# EAGLE design ORPExpansion (EAGLE 6.1)
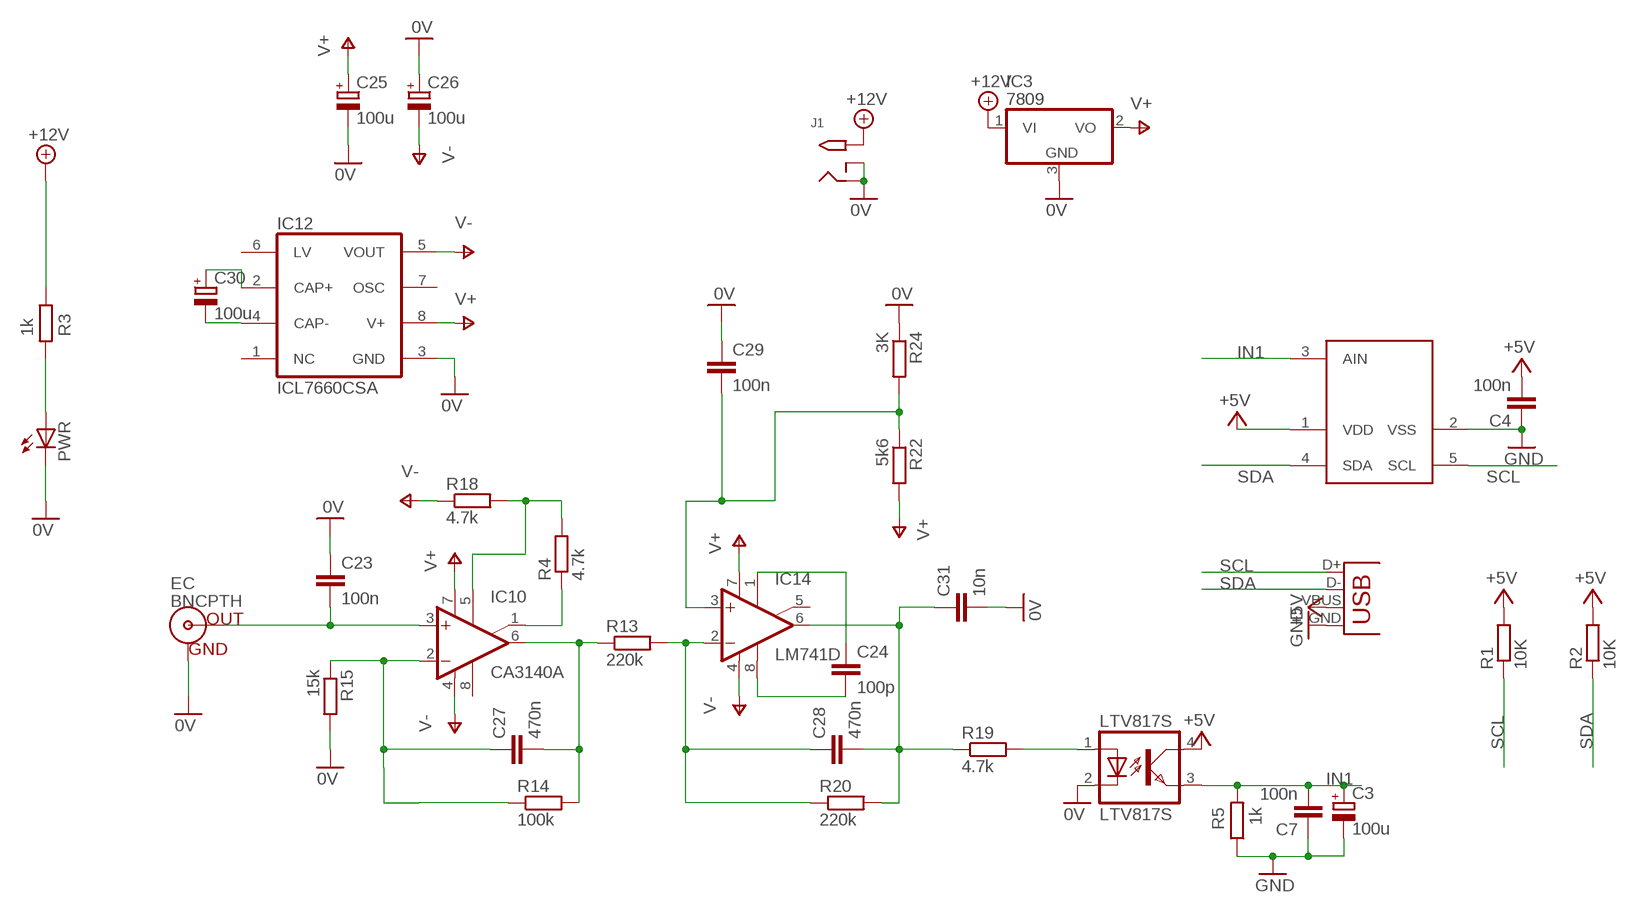
[diagram p0: schematic, sheet 1]

## Parts
C3  100u  CPOL-EUD  [PANASONIC_D]
C4  100n  C-EUC0805K  [C0805K]
C7  100n  C-EUC0805K  [C0805K]
C23  100n  C-EUC0805  [C0805]
C24  100p  C-EUC0805  [C0805]
C25  100u  CPOL-EUD  [PANASONIC_D]
C26  100u  CPOL-EUD  [PANASONIC_D]
C27  470n  C-EUC0805  [C0805]
C28  470n  C-EUC0805  [C0805]
C29  100n  C-EUC0805  [C0805]
C30  100u  CPOL-EUD  [PANASONIC_D]
C31  10n  C-EUC0805  [C0805]
EC  BNCPTH  [BNC]
IC3  7809  7805DT  [TO252]
IC10  CA3140A  CA3140D  [SO08]
IC12  ICL7660CSA  [SO08]
IC14  LM741D  [SO08]
J1  2.1MMJACKTHM  [PJ-102A]
LTV817S  LTV817S  LTV816S  [SMD4]
PWR  LED3MM  [LED3MM]
R1  10K  R-EU_R0805  [R0805]
R2  10K  R-EU_R0805  [R0805]
R3  1k  R-EU_R0805  [R0805]
R4  4.7k  R-EU_R0805  [R0805]
R5  1k  R-EU_R0805  [R0805]
R13  220k  R-EU_R0805  [R0805]
R14  100k  R-EU_R0805  [R0805]
R15  15k  R-EU_R0805  [R0805]
R18  4.7k  R-EU_R0805  [R0805]
R19  4.7k  R-EU_R0805  [R0805]
R20  220k  R-EU_R0805  [R0805]
R22  5k6  R-EU_R0805  [R0805]
R24  3K  R-EU_R0805  [R0805]
U$2  MCP3221  [SOT23-5]
X5  USBSMD  [USB-MINIB]

## Nets
0V: C23.1 C25.- C26.+ C29.1 C31.2 EC.GND IC3.3(GND) IC12.3(GND) J1.RING J1.RING_SW LTV817S.2(C) PWR.K(C) R15.2 R24.1
+5V: C4.2 LTV817S.4(COL) R1.2 R2.2 U$2.1(VDD) X5.VBUS
+12V: IC3.1(VI) J1.TIP R3.1
GND [gnd]: C3.- C4.1 C7.1 R5.1 U$2.2(VSS) X5.GND
IN1: C3.+ C7.2 LTV817S.3(EMIT) R5.2 U$2.3(AIN)
N$10: PWR.A R3.2
N$12: C24.1 IC14.1(ON1)
N$41: C29.2 IC14.3(+IN) R22.1 R24.2
N$42: C30.- IC12.4(CAP-)
N$43: C30.+ IC12.2(CAP+)
N$44: C23.2 EC.S(OUT) IC10.3(+IN)
N$45: C24.2 IC14.8(OPT)
N$47: C27.2 IC10.6(OUT) R13.1 R14.2
N$48: C27.1 IC10.2(-IN) R14.1 R15.1
N$50: IC10.5(ON) R4.2 R18.2
N$51: IC10.1(ON/CMP) R4.1
N$53: C28.1 IC14.2(-IN) R13.2 R20.1
N$54: LTV817S.1(A) R19.2
N$55: C28.2 C31.1 IC14.6(OUT) R19.1 R20.2
SCL: R1.1 U$2.5(SCL) X5.D+
SDA: R2.1 U$2.4(SDA) X5.D-
V+: C25.+ IC3.2(VO) IC10.7(V+) IC12.8(V+) IC14.7(V+) R22.2
V-: C26.- IC10.4(V-) IC12.5(VOUT) IC14.4(V-) R18.1
Unconnected: IC10.8(CMP) IC12.1(NC) IC12.6(LV) IC12.7(OSC) IC14.5(ON2)

## Library data of the parts
C3 C25 C26 C30 = rcl:CPOL-EU: POLARIZED CAPACITOR, European symbol
C4 C7 C23 C24 C27-C29 C31 = rcl:C-EU: CAPACITOR, European symbol
EC = SparkFun:BNC: BNC Connector, Mouser Part# 5227161
IC3 = adafruit:78*: Positive VOLTAGE REGULATOR Added bigger pads to the TO-92 package
IC10 = linear:CA3140: OP AMP
IC12 = maxim:ICL7660CSA: VOLTAGE CONVERTER
IC14 = linear:*741: OP AMP
J1 = adafruit:2.1MMJACK: 2.1mm x 5.5mm THM DC jack with internal switch. Digikey part #PJ-102A, 4UCON part #05537 2.1mm x 5.5mm SMT DC jack with internal switch. Digikey part #PJ-002A-SMT, 4UCON part #03267 By microbuilder.eu & adafruit.com
LTV817S = optocoupler:LTV816: OPTO COUPLER Source: LITEON, LTV816.pdf; OC_FARNELL: unknown; OC_NEWARK: unknown
PWR = led:LED: LED OSRAM: - CHIPLED LG R971, LG N971, LY N971, LG Q971, LY Q971, LO R971, LY R971 LH N974, LH R974 LS Q976, LO Q976, LY Q976 LO Q996 - Hyper CHIPLED LW Q18S LB Q993, LB Q99A, LB R99A - SideLED LS A670, LO A670, LY A670, LG A670, LP A670 LB A673, LV A673, LT A673, LW A673 LH A674 LY A675 LS A676, LA A676, LO A676, LY A676, LW A676 LS A679, LY A679, LG A679 - Hyper Micro SIDELED® LS Y876, LA Y876, LO Y876, LY Y876 LT Y87S - SmartLED LW L88C, LW L88S LB L89C, LB L89S, LG L890 LS L89K, LO L89K, LY L89K LS L896, LA L896, LO L896, LY L896 - TOPLED LS T670, LO T670, LY T670, LG T670, LP T670 LSG T670, LSP T670, LSY T670, LOP T670, LYG T670 LG T671, LOG T671, LSG T671 LB T673, LV T673, LT T673, LW T673 LH T674 LS T676, LA T676, LO T676, LY T676, LB T676, LH T676, LSB T676, LW T676 LB T67C, LV T67C, LT T67C, LS T67K, LO T67K, LY T67K, LW E67C LS E67B, LA E67B, LO E67B, LY E67B, LB E67C, LV E67C, LT E67C LW T67C LS T679, LY T679, LG T679 LS T770, LO T770, LY T770, LG T770, LP T770 LB T773, LV T773, LT T773, LW T773 LH T774 LS E675, LA E675, LY E675, LS T675 LS T776, LA T776, LO T776, LY T776, LB T776 LHGB T686 LT T68C, LB T68C - Hyper Mini TOPLED® LB M676 - Mini TOPLED Santana® LG M470 LS M47K, LO M47K, LY M47K Source: http://www.osram.convergy.de LUXEON: - LUMILED® LXK2-PW12-R00, LXK2-PW12-S00, LXK2-PW14-U00, LXK2-PW14-V00 LXK2-PM12-R00, LXK2-PM12-S00, LXK2-PM14-U00 LXK2-PE12-Q00, LXK2-PE12-R00, LXK2-PE12-S00, LXK2-PE14-T00, LXK2-PE14-U00 LXK2-PB12-K00, LXK2-PB12-L00, LXK2-PB12-M00, LXK2-PB14-N00, LXK2-PB14-P00, LXK2-PB14-Q00 LXK2-PR12-L00, LXK2-PR12-M00, LXK2-PR14-Q00, LXK2-PR14-R00 LXK2-PD12-Q00, LXK2-PD12-R00, LXK2-PD12-S00 LXK2-PH12-R00, LXK2-PH12-S00 LXK2-PL12-P00, LXK2-PL12-Q00, LXK2-PL12-R00 Source: www.luxeon.com KINGBRIGHT: KA-3528ASYC Source: www.kingbright.com
R1-R5 R13-R15 R18-R20 R22 R24 = rcl:R-EU_: RESISTOR, European symbol
U$2 = MCP3426:MCP3221
X5 = SparkFun:USB: USB Connectors USB-B-PTH is fully proven SKU : PRT-00139 USB-miniB is fully proven SKU : PRT-00587 USB-A-PCB is untested. USB-A-H is throughly reviewed, but untested. Spark Fun Electronics SKU : PRT-00437 USB-B-SMT is throughly reviewed, but untested. Needs silkscreen touching up. USB-A-S has not been used/tested USB-MB-H has not been used/tested

## Net classes
0 default: width 0.305 mm, drill 0.305 mm, clearance 0.203 mm
1 power: width 0.254 mm, drill 0.254 mm, clearance 0.229 mm
2 gnd: width 0.305 mm, drill 0.508 mm, clearance 0.203 mm

## Board
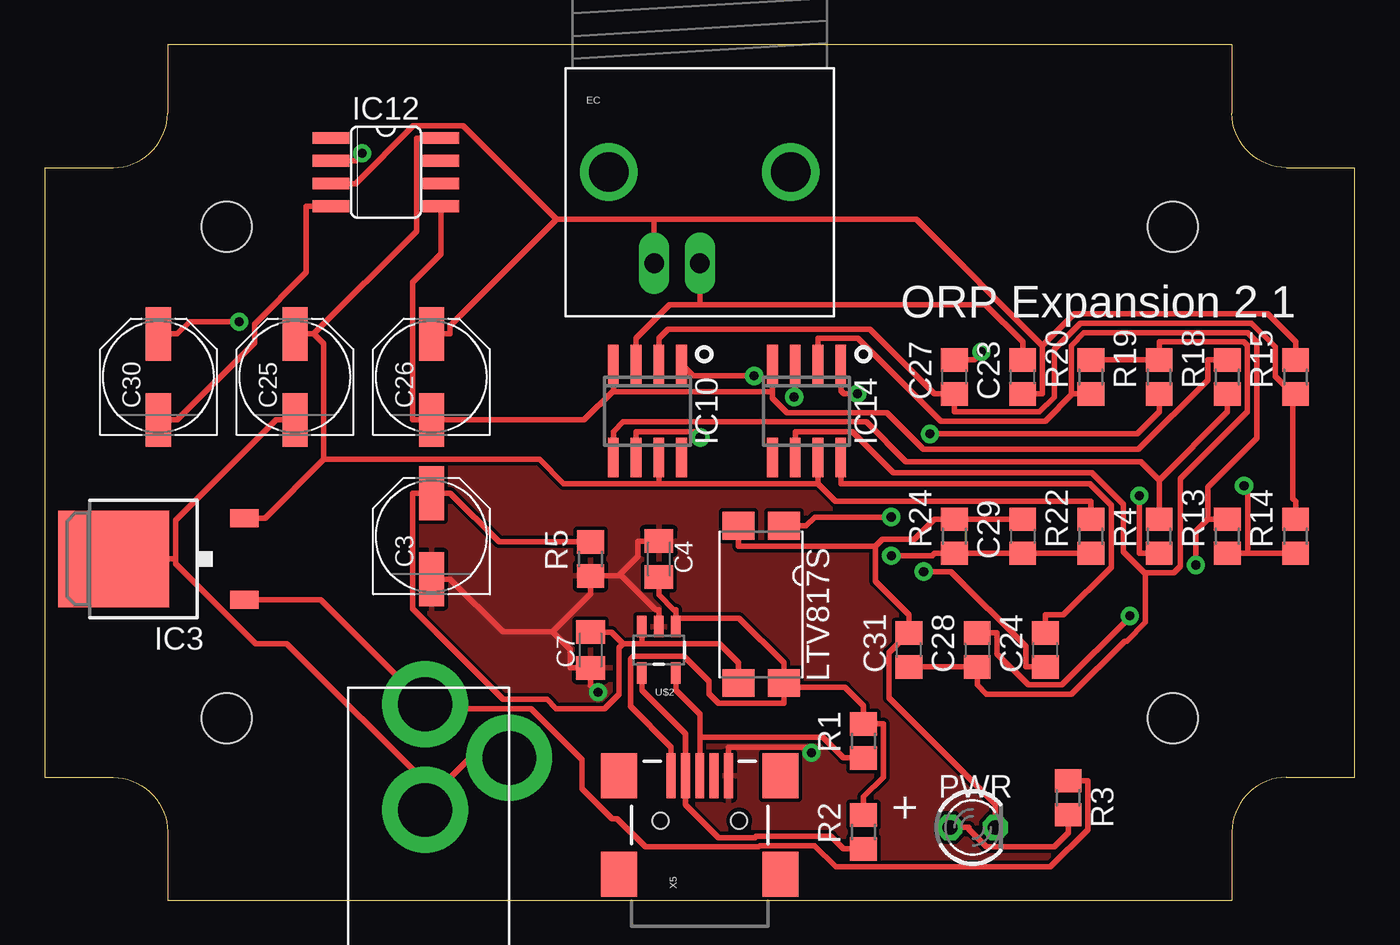
[diagram p1: board, top side]
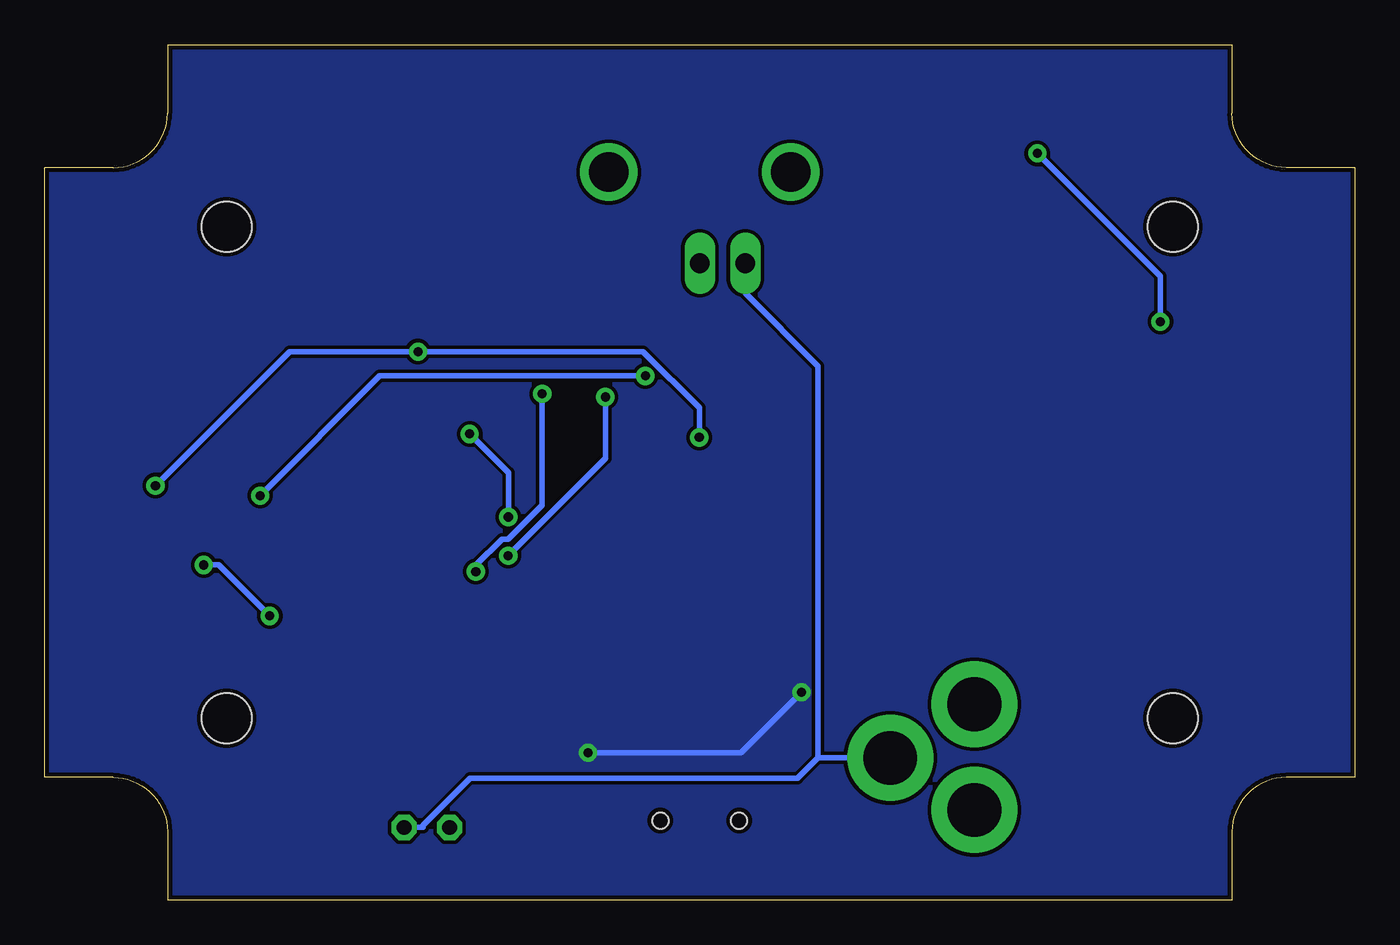
[diagram p2: board, bottom side, seen from below]

Size 73.15 x 47.75 mm. Coordinates in mm from the lower left corner, seen from the top.
Outline: 73.15,6.86 73.15,40.89 69.34,40.89 arc-90 66.29,43.94 66.29,47.75 6.86,47.75 6.86,43.94 arc-90 3.81,40.89 0,40.89 0,6.86 3.81,6.86 arc-90 6.86,3.81 6.86,0 66.29,0 66.29,3.81 arc-90 69.34,6.86 73.15,6.86
Copper layers (1*16): Top 0.035mm / dielectric 1.5mm / Bottom 0.035mm
Design rules: minimum track width 8mil, minimum drill 20mil, track to track 8mil, track to pad 8mil, pad to pad 8mil, via to via 8mil, smd to smd 8mil, copper to edge 10mil, drill to drill 8mil, minimum pad ring 12mil, minimum via ring 10mil, stop-mask expansion 4mil, vias tented up to drill 25mil, thermal gap 10mil
Holes 2.8 mm at 10.16,10.16 10.16,37.59 62.99,37.59 62.99,10.16

### Footprints (pad centres in the part's own frame; a part is rotated, then mirrored left to right if it is on the bottom)
PANASONIC_D = smd 3 x 1.4: + 2.4,0; - -2.4,0
C0805K = smd 1.3 x 1.6: 1 -1,0; 2 1,0
C0805 = smd 1.3 x 1.5: 1 -0.95,0; 2 0.95,0
BNC = drill 2.2: 3 -5.08,5.08; 4 5.08,5.08 | drill 1.1 long: GND -2.54,0; S 0,0
TO252 = smd 1 x 1.6: 1 -2.28,-4.8; 2 2.28,-4.8 | smd 5.4 x 6.2: 3 0,2.5
SO08 = smd 0.6 x 2.2: 1 -1.905,-2.6; 2 -0.635,-2.6; 3 0.635,-2.6; 4 1.905,-2.6; 5 1.905,2.6; 6 0.635,2.6; 7 -0.635,2.6; 8 -1.905,2.6
SO08' = smd 0.66 x 2.032: 1 -1.905,-3.073; 2 -0.635,-3.073; 3 0.635,-3.073; 4 1.905,-3.073; 5 1.905,3.073; 6 0.635,3.073; 7 -0.635,3.073; 8 -1.905,3.073
PJ-102A = drill 3 pad 4.8: RING 0.1,-3.39; RING_SW -4.6,-6.29; TIP 0.1,-9.29
SMD4 = smd 1.78 x 1.55: 1 -1.27,-4.389; 2 1.27,-4.389; 3 1.27,4.389; 4 -1.27,4.389
LED3MM = drill 0.813 octagon: A -1.27,0; K 1.27,0
R0805 = smd 1.3 x 1.5: 1 -0.95,0; 2 0.95,0
SOT23-5 = smd 0.55 x 1.2: 1 -0.95,-1.3; 2 0,-1.3; 3 0.95,-1.3; 4 0.95,1.3; 5 -0.95,1.3
USB-MINIB = smd 2.5 x 0.5: D+ 2.5,0; D- 2.5,0.8; GND 2.5,-1.6; ID 2.5,-0.8; VBUS 2.5,1.6 | smd 2.5 x 2: GND@1 -3,-4.5; GND@2 -3,4.5; GND@3 2.5,4.5; GND@4 2.5,-4.5 | hole 0.9: 0,2.2; 0,-2.2

### Placement (x,y rotation side)
C3  21.59,20.32 90 top
C4  34.29,19.05 270 top
C7  30.48,13.97 90 top
C23  54.61,29.21 90 top
C24  55.88,13.97 90 top
C25  13.97,29.21 90 top
C26  21.59,29.21 90 top
C27  50.8,29.21 90 top
C28  52.07,13.97 270 top
C29  54.61,20.32 270 top
C30  6.35,29.21 90 top
C31  48.26,13.97 90 top
EC  36.58,35.56 0 top
IC3  6.35,19.05 90 top
IC10  33.66,27.3 180 top
IC12  ICL7660CSA  [SO08']  19.05,40.64 270 top
IC14  42.55,27.3 180 top
J1  21.34,1.65 180 top
LTV817S  40.01,16.51 180 top
PWR  51.82,4.06 0 top
R1  45.72,8.89 90 top
R2  45.72,3.81 90 top
R3  57.15,5.71 270 top
R4  62.23,20.32 90 top
R5  30.48,19.05 90 top
R13  66.04,20.32 90 top
R14  69.85,20.32 270 top
R15  69.85,29.21 90 top
R18  66.04,29.21 270 top
R19  62.23,29.21 270 top
R20  58.42,29.21 90 top
R22  58.42,20.32 90 top
R24  50.8,20.32 270 top
U$2  34.29,13.97 180 top
X5  36.58,4.45 90 top

### Tracks (layer width: path | path; a pad name or v marks a point on that pad's centre or on a via)
0V
  Top 0.305: 21.83,6.02 13.52,14.33 11.78,14.33 7.31,18.8 7.31,19.05 | J1.RING 21.83,5.63 21.83,6.02 | J1.RING_SW 23.75,7.94 21.83,6.02 | R15.2 69.85,31.17 68.29,32.73 57.48,32.73 55.72,30.96 | 55.72,30.96 55.72,28.26 C23.1 | 34.04,38.01 48.67,38.01 55.72,30.96 | 28.58,38.01 34.04,38.01 | 46.39,19.77 46.77,20.14 48.57,20.14 49.69,21.27 R24.1 C29.1 | 46.39,19.77 46.39,17.79 48.26,15.93 C31.2 47.15,13.82 47.15,11.29 53.09,5.36 PWR.K | 46.39,19.77 38.73,19.77 LTV817S.2 | C25.- 12.91,26.81 7.31,21.2 7.31,19.05 | C26.+ 22.65,31.61 22.65,32.07 28.58,38.01 | 28.58,38.01 23.35,43.23 20.57,43.23 17.35,40.01 IC12.3 | IC3.3 7.31,19.05 | EC.GND 34.04,38.01
  Bottom 0.305: 29.98,7.94 29.98,29.82 34.04,33.88 EC.GND | 29.98,7.94 31.12,6.8 49.41,6.8 52.02,4.2 52.02,4.06 PWR.K | 29.98,7.94 J1.RING_SW
+5V
  Top 0.305: R2.2 45.72,5.77 46.83,6.87 46.83,9.84 R1.2 45.72,10.85 44.69,11.88 41.27,11.88 | 41.27,11.88 41.27,10.99 37.63,10.99 37.08,11.53 37.08,12.23 35.69,13.63 32.89,13.63 32.71,13.44 32.71,10.82 34.98,8.55 X5.VBUS | 41.27,11.88 LTV817S.4 41.27,13.25 38.78,15.75 35.24,15.75 | 35.24,15.75 35.24,16.23 35.11,16.23 34.29,17.04 C4.2 | U$2.1 35.24,15.75
+12V
  Top 0.305: R3.1 58.26,6.67 58.26,3.94 56.17,1.85 44.19,1.85 42.99,3.05 39.93,3.05 39.86,2.98 33.54,2.98 31.96,4.55 31.66,4.55 29.99,6.23 29.99,7.85 27.14,10.7 21.48,10.7 J1.TIP 15.41,16.77 IC3.1
GND  (via drill 0.51 pad 1.02)
  Top 0.305: v30.9,11.6 30.54,11.96 30.48,11.96 C7.1 29.32,12.97 29.32,14.01 28.36,14.97 | 28.36,14.97 25.59,14.97 22.65,17.92 C3.- | 28.36,14.97 30.48,17.09 R5.1 30.93,18.1 31.59,18.1 32.02,18.1 32.12,18.2 | 32.12,18.2 33.13,19.21 33.13,20.05 C4.1 | 32.12,18.2 34.09,16.23 34.29,16.23 U$2.2 | v42.81,8.23 42.49,8.55 38.18,8.55 X5.GND
  Bottom 0.305: v42.81,8.23 34.26,8.23 v30.9,11.6
  pour Top: -1.27,49.53 74.93,49.53 74.93,0 -1.27,0
  pour Bottom: -1.27,50.8 76.2,50.8 76.2,-1.27 -1.27,-1.27
IN1
  Top 0.305: 32.29,14.31 32.08,14.1 32.08,11.51 31.26,10.7 28.56,10.7 28.06,11.21 25.59,11.21 20.53,16.27 20.53,22.72 C3.+ 22.65,22.72 25.37,20 29.57,20 R5.2 | 33.34,14.31 32.29,14.31 | 32.29,14.31 31.64,14.97 C7.2 | LTV817S.3 38.73,13.25 37.67,14.31 33.34,14.31 | U$2.3 33.34,14.31
N$10
  Top 0.305: PWR.A 51.61,4.06 51.61,3.95 52.58,2.99 56.38,2.99 57.15,3.76 R3.2
N$12  (via drill 0.51 pad 1.02)
  Top 0.305: v45.37,28.27 44.63,28.27 44.45,28.45 IC14.1 | C24.1 54.77,13.02 54.77,14.17 50.6,18.34 v49.08,18.34
  Bottom 0.305: v49.08,18.34 49.08,18.69 47.63,20.14 47.28,20.14 45.37,22.05 v45.37,28.27
N$41  (via drill 0.51 pad 1.02)
  Top 0.305: IC14.3 41.91,28.16 v41.85,28.09 | v47.27,19.23 49.56,19.23 49.69,19.37 R24.2 C29.2 R22.1
  Bottom 0.305: v47.27,19.23 41.85,24.66 v41.85,28.09
N$42
  Top 0.305: C30.- 7.41,26.81 11.71,31.12 11.71,32.16 14.61,35.05 14.61,38.73 IC12.4
N$43  (via drill 0.51 pad 1.02)
  Top 0.305: IC12.2 17.35,41.27 17.35,41.32 v17.73,41.69 | C30.+ 7.41,31.61 8.09,32.3 v10.85,32.3
  Bottom 0.305: v17.73,41.69 10.85,34.82 v10.85,32.3
N$44
  Top 0.305: 36.58,33.24 52.53,33.24 54.61,31.17 C23.2 | IC10.3 33.02,31.36 34.9,33.24 36.58,33.24 | EC.S 36.58,33.24
N$45
  Top 0.305: C24.2 55.88,15.93 56.89,15.93 59.55,18.59 59.55,22.05 58.35,23.25 44.45,23.25 IC14.8
N$47  (via drill 0.51 pad 1.02)
  Top 0.305: 67.19,19.37 67.19,22.92 v66.97,23.14 | 67.19,19.37 R14.2 | R13.1 67.19,19.37 | v52.31,30.62 52.31,30.56 51.91,30.16 C27.2 | v36.6,25.83 36.28,26.16 33.02,26.16 IC10.6
  Bottom 0.305: v66.97,23.14 59.49,30.62 v52.31,30.62 39.74,30.62 36.6,27.48 v36.6,25.83
N$48
  Top 0.305: 69.7,28.26 68.71,29.25 68.71,30.88 67.37,32.22 57.84,32.22 56.39,30.77 56.39,28.09 55.55,27.25 50.8,27.25 C27.1 50.25,28.26 49.69,28.26 46.09,31.87 34.8,31.87 34.29,31.36 IC10.2 | 69.7,28.26 69.7,22.42 69.85,22.28 R14.1 | R15.1 69.7,28.26
N$50
  Top 0.305: 62.23,23.44 61.2,24.48 48.09,24.48 45.88,26.7 32.29,26.7 31.75,26.16 IC10.5 | 62.23,23.44 66.04,27.25 R18.2 | 62.23,23.44 62.23,22.28 R4.2
N$51  (via drill 0.51 pad 1.02)
  Top 0.305: v61.12,22.58 61.12,19.37 R4.1 | IC10.1 36.2,29.27 v39.62,29.27
  Bottom 0.305: v39.62,29.27 54.44,29.27 v61.12,22.58
N$53  (via drill 0.51 pad 1.02)
  Top 0.305: 57.4,28.26 55.88,26.74 50.03,26.74 45.42,31.36 43.18,31.36 IC14.2 | 64.93,21.27 64.93,23.04 67.68,25.79 67.68,31.19 67.19,31.68 58.03,31.68 57.31,30.96 57.31,28.34 57.4,28.26 | R20.1 57.4,28.26 | v60.59,15.87 60.59,15.8 56.8,12.01 54.92,12.01 53.18,13.76 53.18,14.92 C28.1 | v64.27,18.71 64.27,20.61 64.93,21.27 | R13.2 64.93,21.27
  Bottom 0.305: v60.59,15.87 63.43,18.71 v64.27,18.71
N$54  (via drill 0.51 pad 1.02)
  Top 0.305: v49.43,26.03 61.01,26.03 62.23,27.25 R19.2 | v47.27,21.39 43.01,21.39 42.52,20.9 LTV817S.1
  Bottom 0.305: v47.27,21.39 47.27,23.87 v49.43,26.03
N$55
  Top 0.305: 61.46,18.29 61.4,18.29 60.24,19.45 60.24,22.11 58.47,23.88 47.39,23.88 45.11,26.16 41.91,26.16 IC14.6 | 61.46,18.29 63.06,18.29 63.41,18.64 63.41,23.52 67.15,27.25 67.15,30.98 66.96,31.17 62.23,31.17 R19.1 59.53,30.16 58.85,30.16 R20.2 | 61.46,18.29 61.46,15.51 60.42,14.46 60.3,14.46 57.34,11.49 52.59,11.49 52.07,12.01 C28.2 50.96,13.02 C31.1
SCL
  Top 0.305: 36.58,9.11 43.45,9.11 44.61,7.94 R1.1 | 36.58,9.11 36.58,10.38 35.24,11.71 U$2.5 | 36.58,9.11 36.58,8.42 36.58,7.62 X5.D+
SDA
  Top 0.305: R2.1 44.61,2.86 43.91,3.56 39.72,3.56 39.66,3.5 37.62,3.5 35.78,5.34 X5.D- 35.78,9.28 33.34,11.71 U$2.4
V+
  Top 0.305: R22.2 58.42,22.28 44.15,22.28 43.18,23.25 | IC12.8 20.75,42.55 20.75,37.34 15.03,31.61 | 15.58,24.61 12.31,21.33 IC3.2 | 34.29,23.25 28.98,23.25 27.62,24.61 15.58,24.61 | 15.58,24.61 15.58,31.05 15.03,31.61 | C25.+ 15.03,31.61 | 43.18,23.25 43.18,23.38 IC14.7 | 43.18,23.25 34.29,23.25 | IC10.7 34.29,23.25
V-
  Top 0.305: IC12.5 22.12,36.09 20.53,34.5 20.53,26.81 C26.- 30.11,26.81 31.75,28.45 | 40.64,28.4 IC14.4 | 40.64,28.4 40.64,28.03 41.46,27.21 47.03,27.21 49.07,25.16 61.07,25.16 64.93,29.03 64.93,30.16 R18.1 | 40.64,28.4 31.8,28.4 31.75,28.45 | IC10.4 31.75,28.45

### Text on the board
tNames: ORP Expansion 2.1 | +